# EAGLE schematic arm-adaptor (EAGLE 6.2)
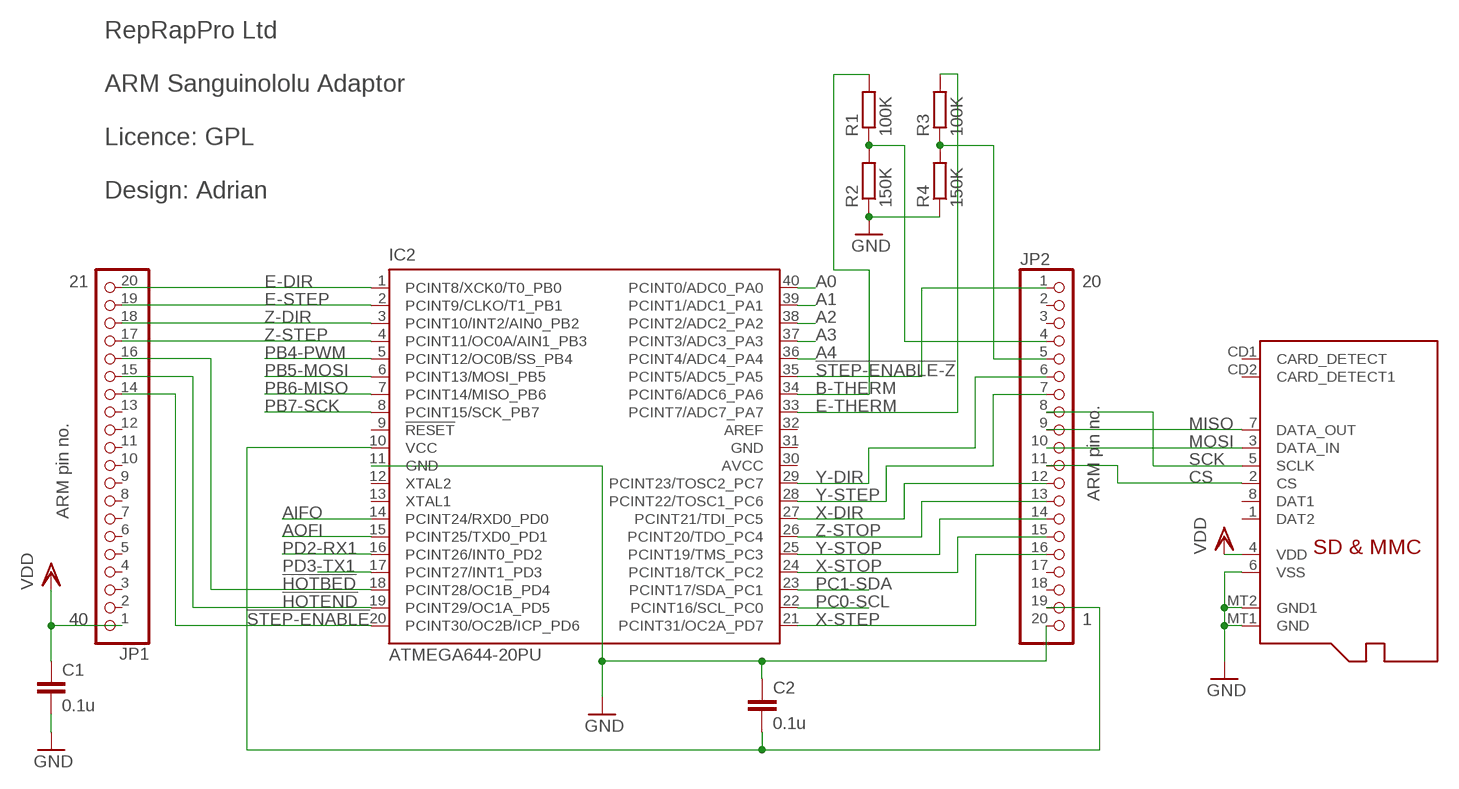
[diagram p0: schematic, sheet 1]

## Parts
C1  0.1u  C-EU025-024X044  [C025-024X044]
C2  0.1u  C-EU025-024X044  [C025-024X044]
IC2  ATMEGA644-20PU  [DIL40]
JP1  PINHD-1X20  [1X20]
JP2  PINHD-1X20  [1X20]
R1  100K  R-EU_0204/5  [0204/5]
R2  150K  R-EU_0204/5  [0204/5]
R3  100K  R-EU_0204/5  [0204/5]
R4  150K  R-EU_0204/5  [0204/5]
X1  MICROSD  [MICROSD]

## Nets
!HOTBED: IC2.18(PCINT28/OC1B_PD4) JP1.16
!HOTEND: IC2.19(PCINT29/OC1A_PD5) JP1.15
!STEP-ENABLE: IC2.20(PCINT30/OC2B/ICP_PD6) JP1.14
!STEP-ENABLE-Z: IC2.35(PCINT5/ADC5_PA5) JP2.1
A0: IC2.40(PCINT0/ADC0_PA0)
A1: IC2.39(PCINT1/ADC1_PA1)
A2: IC2.38(PCINT2/ADC2_PA2)
A3: IC2.37(PCINT3/ADC3_PA3)
A4: IC2.36(PCINT4/ADC4_PA4)
AIFO: IC2.14(PCINT24/RXD0_PD0)
AOFI: IC2.15(PCINT25/TXD0_PD1)
B-THERM: IC2.34(PCINT6/ADC6_PA6) R1.2
CS: JP2.11 X1.2(CS)
E-DIR: IC2.1(PCINT8/XCK0/T0_PB0) JP1.20
E-STEP: IC2.2(PCINT9/CLKO/T1_PB1) JP1.19
E-THERM: IC2.33(PCINT7/ADC7_PA7) R3.2
GND [power]: C1.2 C2.1 IC2.11(GND) JP2.20 R2.1 R4.1 X1.6(VSS) X1.MT1(GND) X1.MT2(GND1)
MISO: JP2.9 X1.7(DATA_OUT)
MOSI: JP2.10 X1.3(DATA_IN)
N$1: JP2.4 R1.1 R2.2
N$2: JP2.5 R3.1 R4.2
PB4-PWM: IC2.5(PCINT12/OC0B/SS_PB4)
PB5-MOSI: IC2.6(PCINT13/MOSI_PB5)
PB6-MISO: IC2.7(PCINT14/MISO_PB6)
PB7-SCK: IC2.8(PCINT15/SCK_PB7)
PC0-SCL: IC2.22(PCINT16/SCL_PC0)
PC1-SDA: IC2.23(PCINT17/SDA_PC1)
PD2-RX1: IC2.16(PCINT26/INT0_PD2)
PD3-TX1: IC2.17(PCINT27/INT1_PD3)
SCK: JP2.8 X1.5(SCLK)
VDD: C1.1 JP1.1 X1.4(VDD)
VIN: C2.2 IC2.10(VCC) JP2.19
X-DIR: IC2.27(PCINT21/TDI_PC5) JP2.12
X-STEP: IC2.21(PCINT31/OC2A_PD7) JP2.16
X-STOP: IC2.24(PCINT18/TCK_PC2) JP2.15
Y-DIR: IC2.29(PCINT23/TOSC2_PC7) JP2.6
Y-STEP: IC2.28(PCINT22/TOSC1_PC6) JP2.7
Y-STOP: IC2.25(PCINT19/TMS_PC3) JP2.14
Z-DIR: IC2.3(PCINT10/INT2/AIN0_PB2) JP1.18
Z-STEP: IC2.4(PCINT11/OC0A/AIN1_PB3) JP1.17
Z-STOP: IC2.26(PCINT20/TDO_PC4) JP2.13
Unconnected: IC2.9(!RESET) IC2.12(XTAL2) IC2.13(XTAL1) IC2.32(AREF) JP1.2 JP1.3 JP1.4 JP1.5 JP1.6 JP1.7 JP1.8 JP1.9 JP1.10 JP1.11 JP1.12 JP1.13 JP2.2 JP2.3 JP2.17 JP2.18 X1.1(DAT2) X1.8(DAT1) X1.CD1(CARD_DETECT) X1.CD2(CARD_DETECT1)

## Notes on the sheet
- RepRapPro Ltd
- ARM Sanguinololu Adaptor
- Licence: GPL
- Design: Adrian
- 21 | 20
- ARM pin no.
- ARM pin no.
- 40 | 1

## Power pins joined to a net without a drawn wire
AVCC: IC2.30(AVCC)
GND: IC2.31(GND)

## Library data of the parts
C1 C2 = rcl:C-EU: CAPACITOR, European symbol
IC2 = atmel:ATMEGA644-*PU: 8-bit Microcontroller with 64K Bytes In-System Programmable Flash Auto generated by make-symbol-device-package-bsdl.ulp Rev. 34 Source: http://www.atmel.com/dyn/resources/prod_documents/doc2593.pdf; MPN: ATMEGA644-20PU; OC_FARNELL: 1288340; OC_NEWARK: 23M5060
JP1 JP2 = pinhead:PINHD-1X20: PIN HEADER
R1-R4 = rcl:R-EU_: RESISTOR, European symbol
X1 = adafruit:MICROSD: Micro-SD / Transflash card holder with SPI pinout For the 3M # 2908-05WB-MG and/or 4UCON #19656 push-push type